# EAGLE schematic RoverWing-cover (EAGLE 9.2.2)
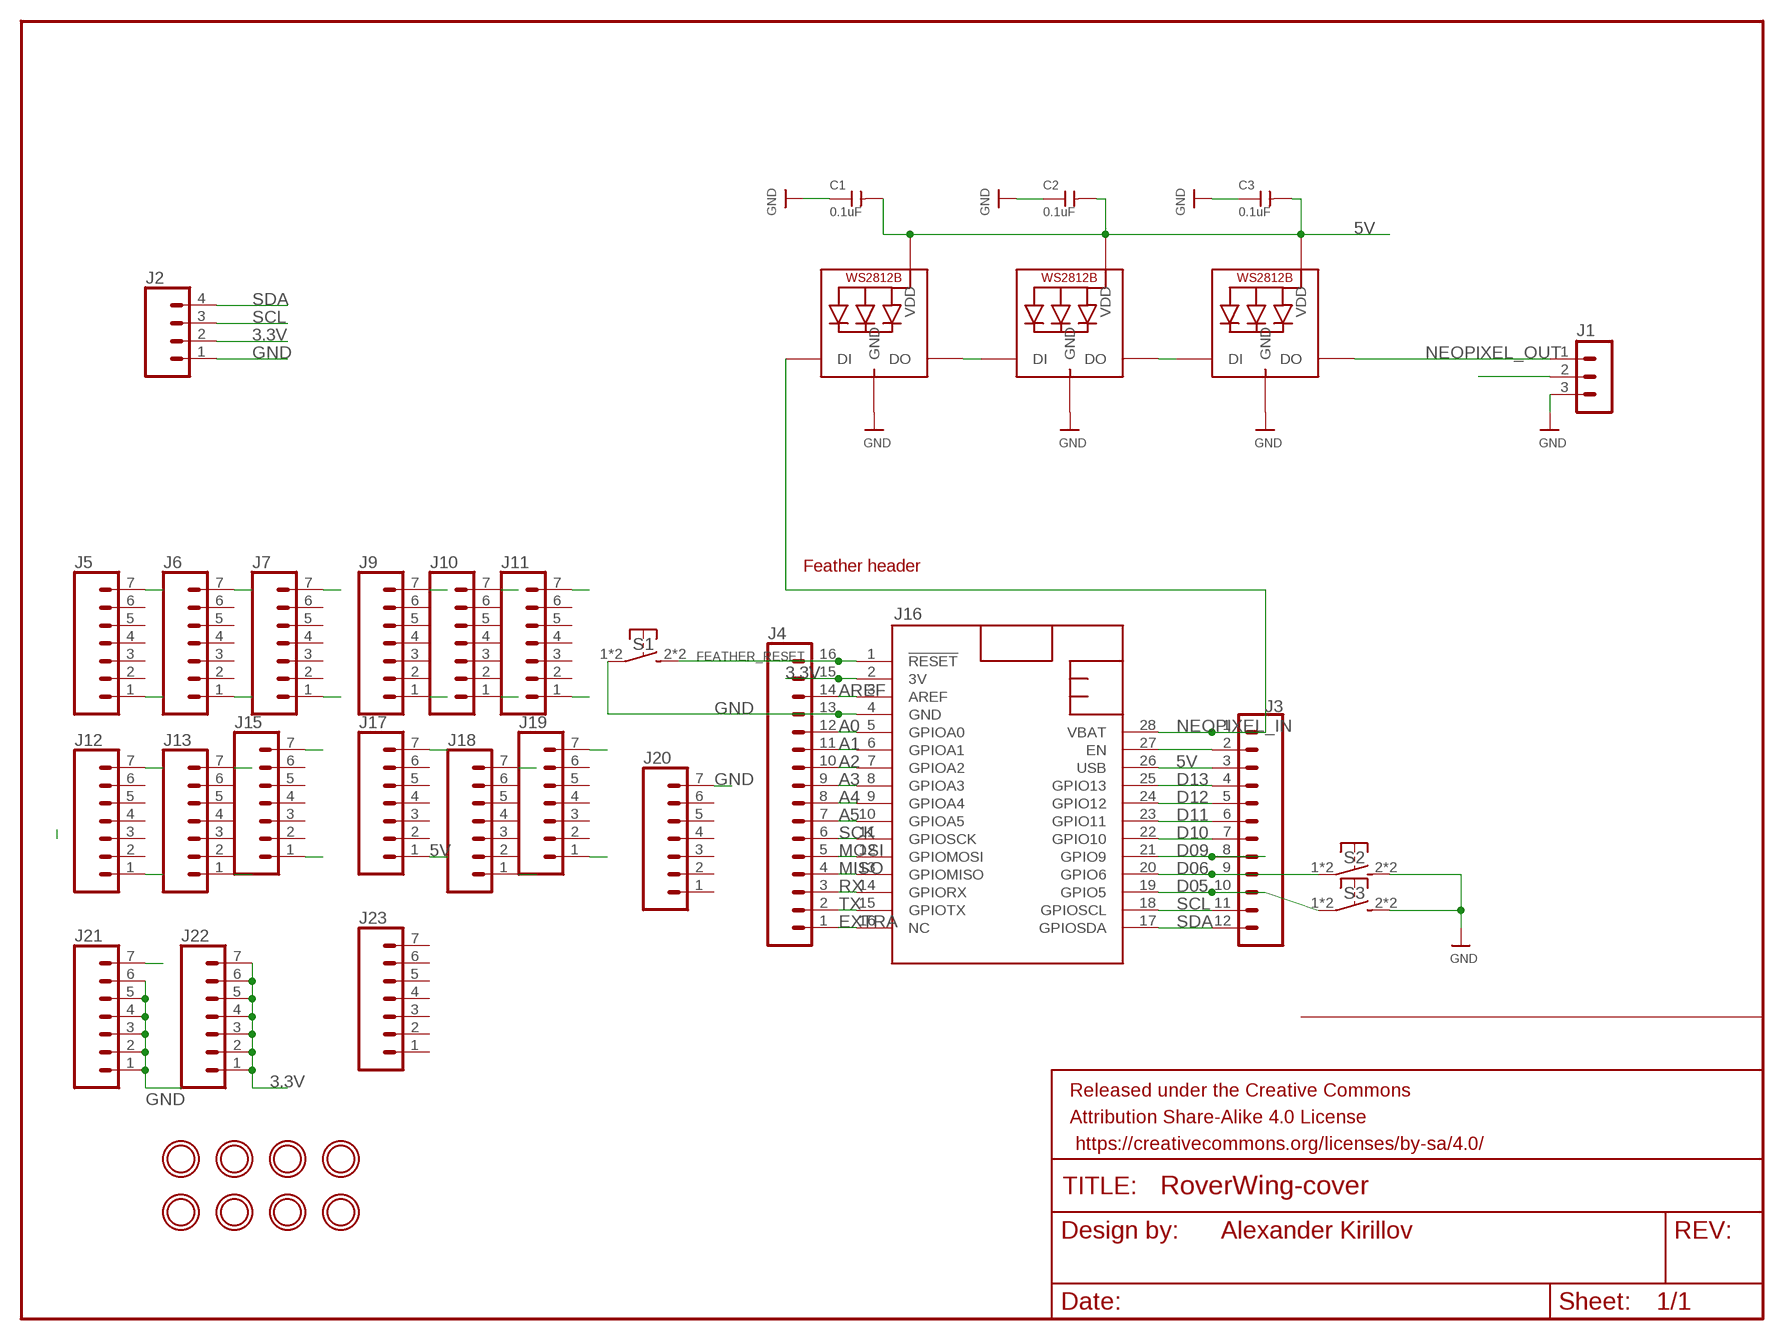
[diagram p0: schematic, sheet 1]

## Parts
C1  0.1uF  CAP-CERAMIC-SMD-0805  [C0805]
C2  0.1uF  CAP-CERAMIC-SMD-0805  [C0805]
C3  0.1uF  CAP-CERAMIC-SMD-0805  [C0805]
FRAME2  FRAME-LETTERNO_PACKAGE  [DUMMY]
J1  HEADER-PH-3P  [B3B-PH-K]
J2  CONN_04  [1X04]
J3  CONN_12NO_SILK  [1X12_NO_SILK]
J4  CONN_161X16_NO_SILK  [1X16_NO_SILK]
J5  CONN_07NO_SILK  [1X07_NO_SILK]
J6  CONN_07NO_SILK  [1X07_NO_SILK]
J7  CONN_07NO_SILK  [1X07_NO_SILK]
J9  CONN_07NO_SILK  [1X07_NO_SILK]
J10  CONN_07NO_SILK  [1X07_NO_SILK]
J11  CONN_07NO_SILK  [1X07_NO_SILK]
J12  CONN_07NO_SILK  [1X07_NO_SILK]
J13  CONN_07NO_SILK  [1X07_NO_SILK]
J15  CONN_07NO_SILK  [1X07_NO_SILK]
J16  FEATHERWING_NODIM  [FEATHERWING_DIM]
J17  CONN_07NO_SILK  [1X07_NO_SILK]
J18  CONN_07NO_SILK  [1X07_NO_SILK]
J19  CONN_07NO_SILK  [1X07_NO_SILK]
J20  CONN_07NO_SILK  [1X07_NO_SILK]
J21  CONN_07NO_SILK  [1X07_NO_SILK]
J22  CONN_07NO_SILK  [1X07_NO_SILK]
J23  CONN_07NO_SILK  [1X07_NO_SILK]
LED1  WS2812B5050  [WS2812B]
LED2  WS2812B5050  [WS2812B]
LED3  WS2812B5050  [WS2812B]
S1  SW-TACTILE-4.5X4.5_SMD  [TL3305]
S2  SW-TACTILE-4.5X4.5_SMD  [TL3305]
S3  SW-TACTILE-4.5X4.5_SMD  [TL3305]
U$3  MOUNTINGHOLE3.0_NPH  [MOUNTINGHOLE_3.0_NPH]
U$4  MOUNTINGHOLE3.0_NPH  [MOUNTINGHOLE_3.0_NPH]
U$14  MOUNTINGHOLE3.0_NPH  [MOUNTINGHOLE_3.0_NPH]
U$15  MOUNTINGHOLE3.0_NPH  [MOUNTINGHOLE_3.0_NPH]
U$24  MOUNTINGHOLE3.0_NPH  [MOUNTINGHOLE_3.0_NPH]
U$25  MOUNTINGHOLE3.0_NPH  [MOUNTINGHOLE_3.0_NPH]
U$26  MOUNTINGHOLE3.0_NPH  [MOUNTINGHOLE_3.0_NPH]
U$27  MOUNTINGHOLE3.0_NPH  [MOUNTINGHOLE_3.0_NPH]

## Nets
3.3V: J2.2 J4.15 J16.2(3V) J22.1 J22.2 J22.3 J22.4 J22.5 J22.6 J22.7
5V: C1.2 C2.2 C3.2 J1.2 J3.3 J16.26(USB) J17.1 LED1.1-VDD(VDD) LED2.1-VDD(VDD) LED3.1-VDD(VDD)
A0: J4.12 J16.5(GPIOA0) J19.7
A1: J4.11 J16.6(GPIOA1) J18.7
A2: J4.10 J16.7(GPIOA2) J17.7
A3: J4.9 J15.7 J16.8(GPIOA3)
A4: J4.8 J13.7 J16.9(GPIOA4)
A5: J4.7 J12.7 J16.10(GPIOA5)
AREF: J4.14 J16.3(AREF) J21.7
D05: J3.10 J7.1 J16.19(GPIO5) S3.1 S3.4(P1)
D06: J3.9 J9.1 J16.20(GPIO6) S2.1 S2.4(P1)
D09: J3.8 J10.1 J16.21(GPIO9)
D10: J3.7 J11.1 J16.22(GPIO10)
D11: J3.6 J12.1 J16.23(GPIO11)
D12: J3.5 J13.1 J16.24(GPIO12)
D13: J3.4 J15.1 J16.25(GPIO13)
EXTRA: J4.1 J5.7 J16.16(NC)
FEATHER_RESET: J4.16 J16.1(!RESET) S1.2(S1) S1.3(S1)
GND: C1.1 C2.1 C3.1 J1.3 J2.1 J4.13 J16.4(GND) J20.7 J21.1 J21.2 J21.3 J21.4 J21.5 J21.6 LED1.3-GND(GND) LED2.3-GND(GND) LED3.3-GND(GND) S1.1 S1.4(P1) S2.2(S1) S2.3(S1) S3.2(S1) S3.3(S1)
MISO: J4.4 J9.7 J16.13(GPIOMISO)
MOSI: J4.5 J10.7 J16.12(GPIOMOSI)
N$1: LED2.2-DOUT(DO) LED3.4-DIN(DI)
N$3: LED1.2-DOUT(DO) LED2.4-DIN(DI)
N$6: J19.1
N$37: J3.2 J16.27(EN) J18.1
NEOPIXEL_IN: J3.1 J16.28(VBAT) LED1.4-DIN(DI)
NEOPIXEL_OUT: J1.1 LED3.2-DOUT(DO)
RX: J4.3 J7.7 J16.14(GPIORX)
SCK: J4.6 J11.7 J16.11(GPIOSCK)
SCL: J2.3 J3.11 J6.1 J16.18(GPIOSCL)
SDA: J2.4 J3.12 J5.1 J16.17(GPIOSDA)
TX: J4.2 J6.7 J16.15(GPIOTX)
Unconnected: J5.2 J5.3 J5.4 J5.5 J5.6 J6.2 J6.3 J6.4 J6.5 J6.6 J7.2 J7.3 J7.4 J7.5 J7.6 J9.2 J9.3 J9.4 J9.5 J9.6 J10.2 J10.3 J10.4 J10.5 J10.6 J11.2 J11.3 J11.4 J11.5 J11.6 J12.2 J12.3 J12.4 J12.5 J12.6 J13.2 J13.3 J13.4 J13.5 J13.6 J15.2 J15.3 J15.4 J15.5 J15.6 J17.2 J17.3 J17.4 J17.5 J17.6 J18.2 J18.3 J18.4 J18.5 J18.6 J19.2 J19.3 J19.4 J19.5 J19.6 J20.1 J20.2 J20.3 J20.4 J20.5 J20.6 J23.1 J23.2 J23.3 J23.4 J23.5 J23.6 J23.7

## Notes on the sheet
- Feather header
- Alexander Kirillov

## Library data of the parts
C1-C3 = RoverWing:CAP-CERAMIC-SMD-0805
FRAME2 = SparkFun-Aesthetics:FRAME-LETTER: Schematic Frame - Letter Standard 8.5x11 US Letter frame; DESIGNER: Nobody; VERSION: v01
J1 = RoverWing:HEADER-PH-3P: HEADER; PARTNO: B3B-PH-K-S(LF)(SN)
J2 = SparkFun-Connectors:CONN_04: Multi connection point. Often used as Generic Header-pin footprint for 0.1 inch spaced/style header connections On any of the 0.1 inch spaced packages, you can populate with these: Break Away Headers - Straight <https://www.sparkfun.com/products/116> (PRT-00116) Break Away Male Headers - Right Angle <https://www.sparkfun.com/products/553> (PRT-00553) Female Headers <https://www.sparkfun.com/products/115> (PRT-00115) Break Away Headers - Machine Pin <https://www.sparkfun.com/products/117> (PRT-00117) Break Away Female Headers - Swiss Machine Pin <https://www.sparkfun.com/products/743> (PRT-00743) For SCREWTERMINALS and SPRING TERMINALS visit here: Screw Terimnals on SparkFun.com <https://www.sparkfun.com/search/results?term=Screw+Terminals> (5mm/3.5mm/2.54mm spacing) This device is also useful as a general connection point to wire up your design to another part of your project. Our various solder wires solder well into these plated through hole pads. Hook-Up Wire - Assortment (Stranded, 22 AWG) <https://www.sparkfun.com/products/11375> (PRT-11375) Hook-Up Wire - Assortment (Solid Core, 22 AWG) <https://www.sparkfun.com/products/11367> (PRT-11367) View the entire wire category on our website here <https://www.sparkfun.com/categories/141> Special notes: Molex polarized connector foot print use with SKU : PRT-08231 with associated crimp pins and housings. 1MM SMD Version SKU: PRT-10208; PROD_ID: CONN-09696
J3 = SparkFun-Connectors:CONN_12: Multi connection point. Often used as Generic Header-pin footprint for 0.1 inch spaced/style header connections On any of the 0.1 inch spaced packages, you can populate with these: Break Away Headers - Straight <https://www.sparkfun.com/products/116> (PRT-00116) Break Away Male Headers - Right Angle <https://www.sparkfun.com/products/553> (PRT-00553) Female Headers <https://www.sparkfun.com/products/115> (PRT-00115) Break Away Headers - Machine Pin <https://www.sparkfun.com/products/117> (PRT-00117) Break Away Female Headers - Swiss Machine Pin <https://www.sparkfun.com/products/743> (PRT-00743) For SCREWTERMINALS and SPRING TERMINALS visit here: Screw Terimnals on SparkFun.com <https://www.sparkfun.com/search/results?term=Screw+Terminals> (5mm/3.5mm/2.54mm spacing) This device is also useful as a general connection point to wire up your design to another part of your project. Our various solder wires solder well into these plated through hole pads. Hook-Up Wire - Assortment (Stranded, 22 AWG) <https://www.sparkfun.com/products/11375> (PRT-11375) Hook-Up Wire - Assortment (Solid Core, 22 AWG) <https://www.sparkfun.com/products/11367> (PRT-11367) View the entire wire category on our website here <https://www.sparkfun.com/categories/141> Special notes: Molex polarized connector foot print use with SKU : PRT-08231 with associated crimp pins and housings. 1MM SMD Version SKU: PRT-10208 NOTES ON THE VARIANTS LOCK and LOCK_LONGPADS... This footprint was designed to help hold the alignment of a through-hole component (i.e. 6-pin header) while soldering it into place. You may notice that each hole has been shifted either up or down by 0.005 of an inch from it's more standard position (which is a perfectly straight line). This slight alteration caused the pins (the squares in the middle) to touch the edges of the holes. Because they are alternating, it causes a "brace" to hold the component in place. 0.005 has proven to be the perfect amount of "off-center" position when using our standard breakaway headers. Although looks a little odd when you look at the bare footprint, once you have a header in there, the alteration is very hard to notice. Also,if you push a header all the way into place, it is covered up entirely on the bottom side.
J4 = SparkFun-Connectors:CONN_16: Multi connection point. Often used as Generic Header-pin footprint for 0.1 inch spaced/style header connections On any of the 0.1 inch spaced packages, you can populate with these: Break Away Headers - Straight <https://www.sparkfun.com/products/116> (PRT-00116) Break Away Male Headers - Right Angle <https://www.sparkfun.com/products/553> (PRT-00553) Female Headers <https://www.sparkfun.com/products/115> (PRT-00115) Break Away Headers - Machine Pin <https://www.sparkfun.com/products/117> (PRT-00117) Break Away Female Headers - Swiss Machine Pin <https://www.sparkfun.com/products/743> (PRT-00743) For SCREWTERMINALS and SPRING TERMINALS visit here: Screw Terimnals on SparkFun.com <https://www.sparkfun.com/search/results?term=Screw+Terminals> (5mm/3.5mm/2.54mm spacing) This device is also useful as a general connection point to wire up your design to another part of your project. Our various solder wires solder well into these plated through hole pads. Hook-Up Wire - Assortment (Stranded, 22 AWG) <https://www.sparkfun.com/products/11375> (PRT-11375) Hook-Up Wire - Assortment (Solid Core, 22 AWG) <https://www.sparkfun.com/products/11367> (PRT-11367) View the entire wire category on our website here <https://www.sparkfun.com/categories/141> Special notes: Molex polarized connector foot print use with SKU : PRT-08231 with associated crimp pins and housings. 1MM SMD Version SKU: PRT-10208 NOTES ON THE VARIANTS LOCK and LOCK_LONGPADS... This footprint was designed to help hold the alignment of a through-hole component (i.e. 6-pin header) while soldering it into place. You may notice that each hole has been shifted either up or down by 0.005 of an inch from it's more standard position (which is a perfectly straight line). This slight alteration caused the pins (the squares in the middle) to touch the edges of the holes. Because they are alternating, it causes a "brace" to hold the component in place. 0.005 has proven to be the perfect amount of "off-center" position when using our standard breakaway headers. Although looks a little odd when you look at the bare footprint, once you have a header in there, the alteration is very hard to notice. Also,if you push a header all the way into place, it is covered up entirely on the bottom side.
J5-J7 J9-J13 J15 J17-J23 = SparkFun-Connectors:CONN_07: Multi connection point. Often used as Generic Header-pin footprint for 0.1 inch spaced/style header connections On any of the 0.1 inch spaced packages, you can populate with these: Break Away Headers - Straight <https://www.sparkfun.com/products/116> (PRT-00116) Break Away Male Headers - Right Angle <https://www.sparkfun.com/products/553> (PRT-00553) Female Headers <https://www.sparkfun.com/products/115> (PRT-00115) Break Away Headers - Machine Pin <https://www.sparkfun.com/products/117> (PRT-00117) Break Away Female Headers - Swiss Machine Pin <https://www.sparkfun.com/products/743> (PRT-00743) For SCREWTERMINALS and SPRING TERMINALS visit here: Screw Terimnals on SparkFun.com <https://www.sparkfun.com/search/results?term=Screw+Terminals> (5mm/3.5mm/2.54mm spacing) This device is also useful as a general connection point to wire up your design to another part of your project. Our various solder wires solder well into these plated through hole pads. Hook-Up Wire - Assortment (Stranded, 22 AWG) <https://www.sparkfun.com/products/11375> (PRT-11375) Hook-Up Wire - Assortment (Solid Core, 22 AWG) <https://www.sparkfun.com/products/11367> (PRT-11367) View the entire wire category on our website here <https://www.sparkfun.com/categories/141> Special notes: Molex polarized connector foot print use with SKU : PRT-08231 with associated crimp pins and housings. 1MM SMD Version SKU: PRT-10208 NOTES ON THE VARIANTS LOCK and LOCK_LONGPADS... This footprint was designed to help hold the alignment of a through-hole component (i.e. 6-pin header) while soldering it into place. You may notice that each hole has been shifted either up or down by 0.005 of an inch from it's more standard position (which is a perfectly straight line). This slight alteration caused the pins (the squares in the middle) to touch the edges of the holes. Because they are alternating, it causes a "brace" to hold the component in place. 0.005 has proven to be the perfect amount of "off-center" position when using our standard breakaway headers. Although looks a little odd when you look at the bare footprint, once you have a header in there, the alteration is very hard to notice. Also,if you push a header all the way into place, it is covered up entirely on the bottom side.
J16 = RoverShield:FEATHERWING: Adafruit Feather
LED1-LED3 = adafruit:WS2812B
S1-S3 = RoverWing:SW-TACTILE: Tactile Switche
U$3 U$4 U$14 U$15 U$24-U$27 = CrickitCopy:MOUNTINGHOLE: Mounting Hole For #2 screws (0.086"/2.18mm width, 0.094"/2.4mm hole) use 2.5mm

## Net classes
1 thinpower: width 0.305 mm
2 thickpower: width 0.406 mm